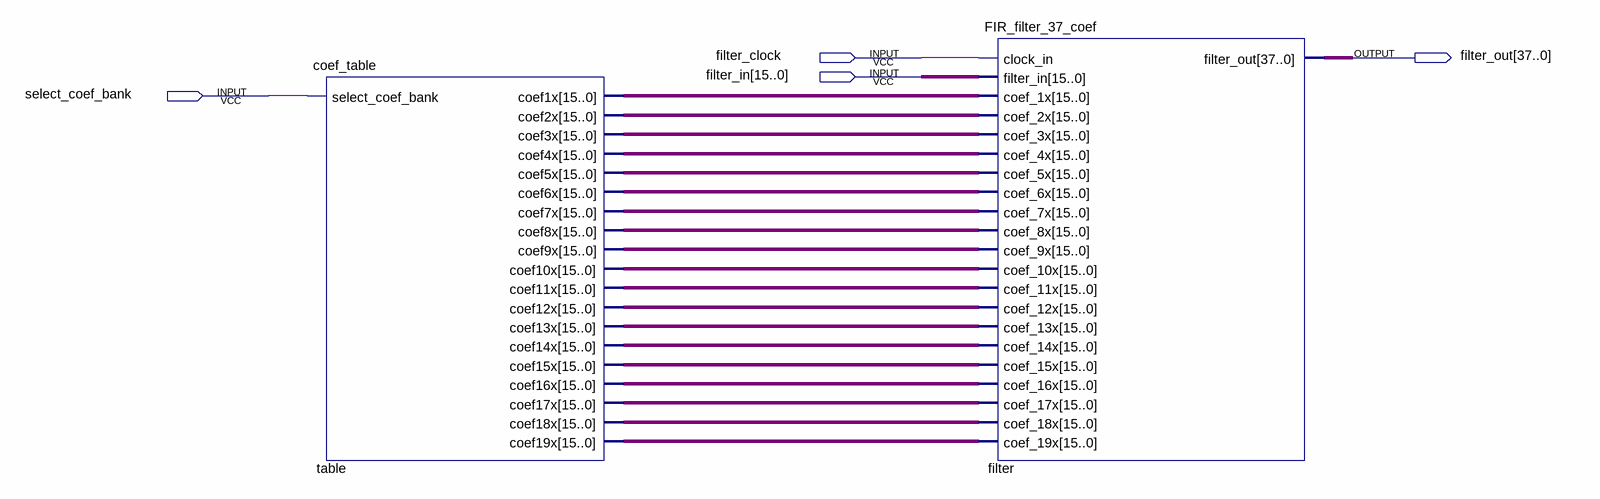
[diagram p0: schematic sheet]
// Quartus schematic FIR_filters.bdf as structural Verilog: 2 symbols, 4 pins
module FIR_filters (
  input  filter_clock,
  input  [15:0] filter_in,
  input  select_coef_bank,
  output [37:0] filter_out
);

  wire [15:0] table_coef1x, table_coef2x, table_coef3x, table_coef4x, table_coef5x, table_coef6x,
       table_coef7x, table_coef8x, table_coef9x, table_coef10x, table_coef11x, table_coef12x, table_coef13x,
       table_coef14x, table_coef15x, table_coef16x, table_coef17x, table_coef18x, table_coef19x;

  coef_table \table  (
    .select_coef_bank(select_coef_bank), .coef1x(table_coef1x), .coef2x(table_coef2x), .coef3x(table_coef3x),
    .coef4x(table_coef4x), .coef5x(table_coef5x), .coef6x(table_coef6x), .coef7x(table_coef7x),
    .coef8x(table_coef8x), .coef9x(table_coef9x), .coef10x(table_coef10x), .coef11x(table_coef11x),
    .coef12x(table_coef12x), .coef13x(table_coef13x), .coef14x(table_coef14x), .coef15x(table_coef15x),
    .coef16x(table_coef16x), .coef17x(table_coef17x), .coef18x(table_coef18x), .coef19x(table_coef19x));
  FIR_filter_37_coef filter (
    .clock_in(filter_clock), .filter_in(filter_in), .coef_1x(table_coef1x), .coef_2x(table_coef2x),
    .coef_3x(table_coef3x), .coef_4x(table_coef4x), .coef_5x(table_coef5x), .coef_6x(table_coef6x),
    .coef_7x(table_coef7x), .coef_8x(table_coef8x), .coef_9x(table_coef9x), .coef_10x(table_coef10x),
    .coef_11x(table_coef11x), .coef_12x(table_coef12x), .coef_13x(table_coef13x), .coef_14x(table_coef14x),
    .coef_15x(table_coef15x), .coef_16x(table_coef16x), .coef_17x(table_coef17x), .coef_18x(table_coef18x),
    .coef_19x(table_coef19x), .filter_out(filter_out));
endmodule
